# Altium schematic sheet Power.SchDoc: Power
size A3; CompanyName: Green Team Twente; Organization: Green Team Twente; Revision: V1.1; SheetNumber: 5; SheetTotal: 10; Team: 2024; Subsystem: Embedded Systems; SPICEModelCacheQRFOQSXK: <root> / <DocumentId>QRFOQSXK</DocumentId> / </root>
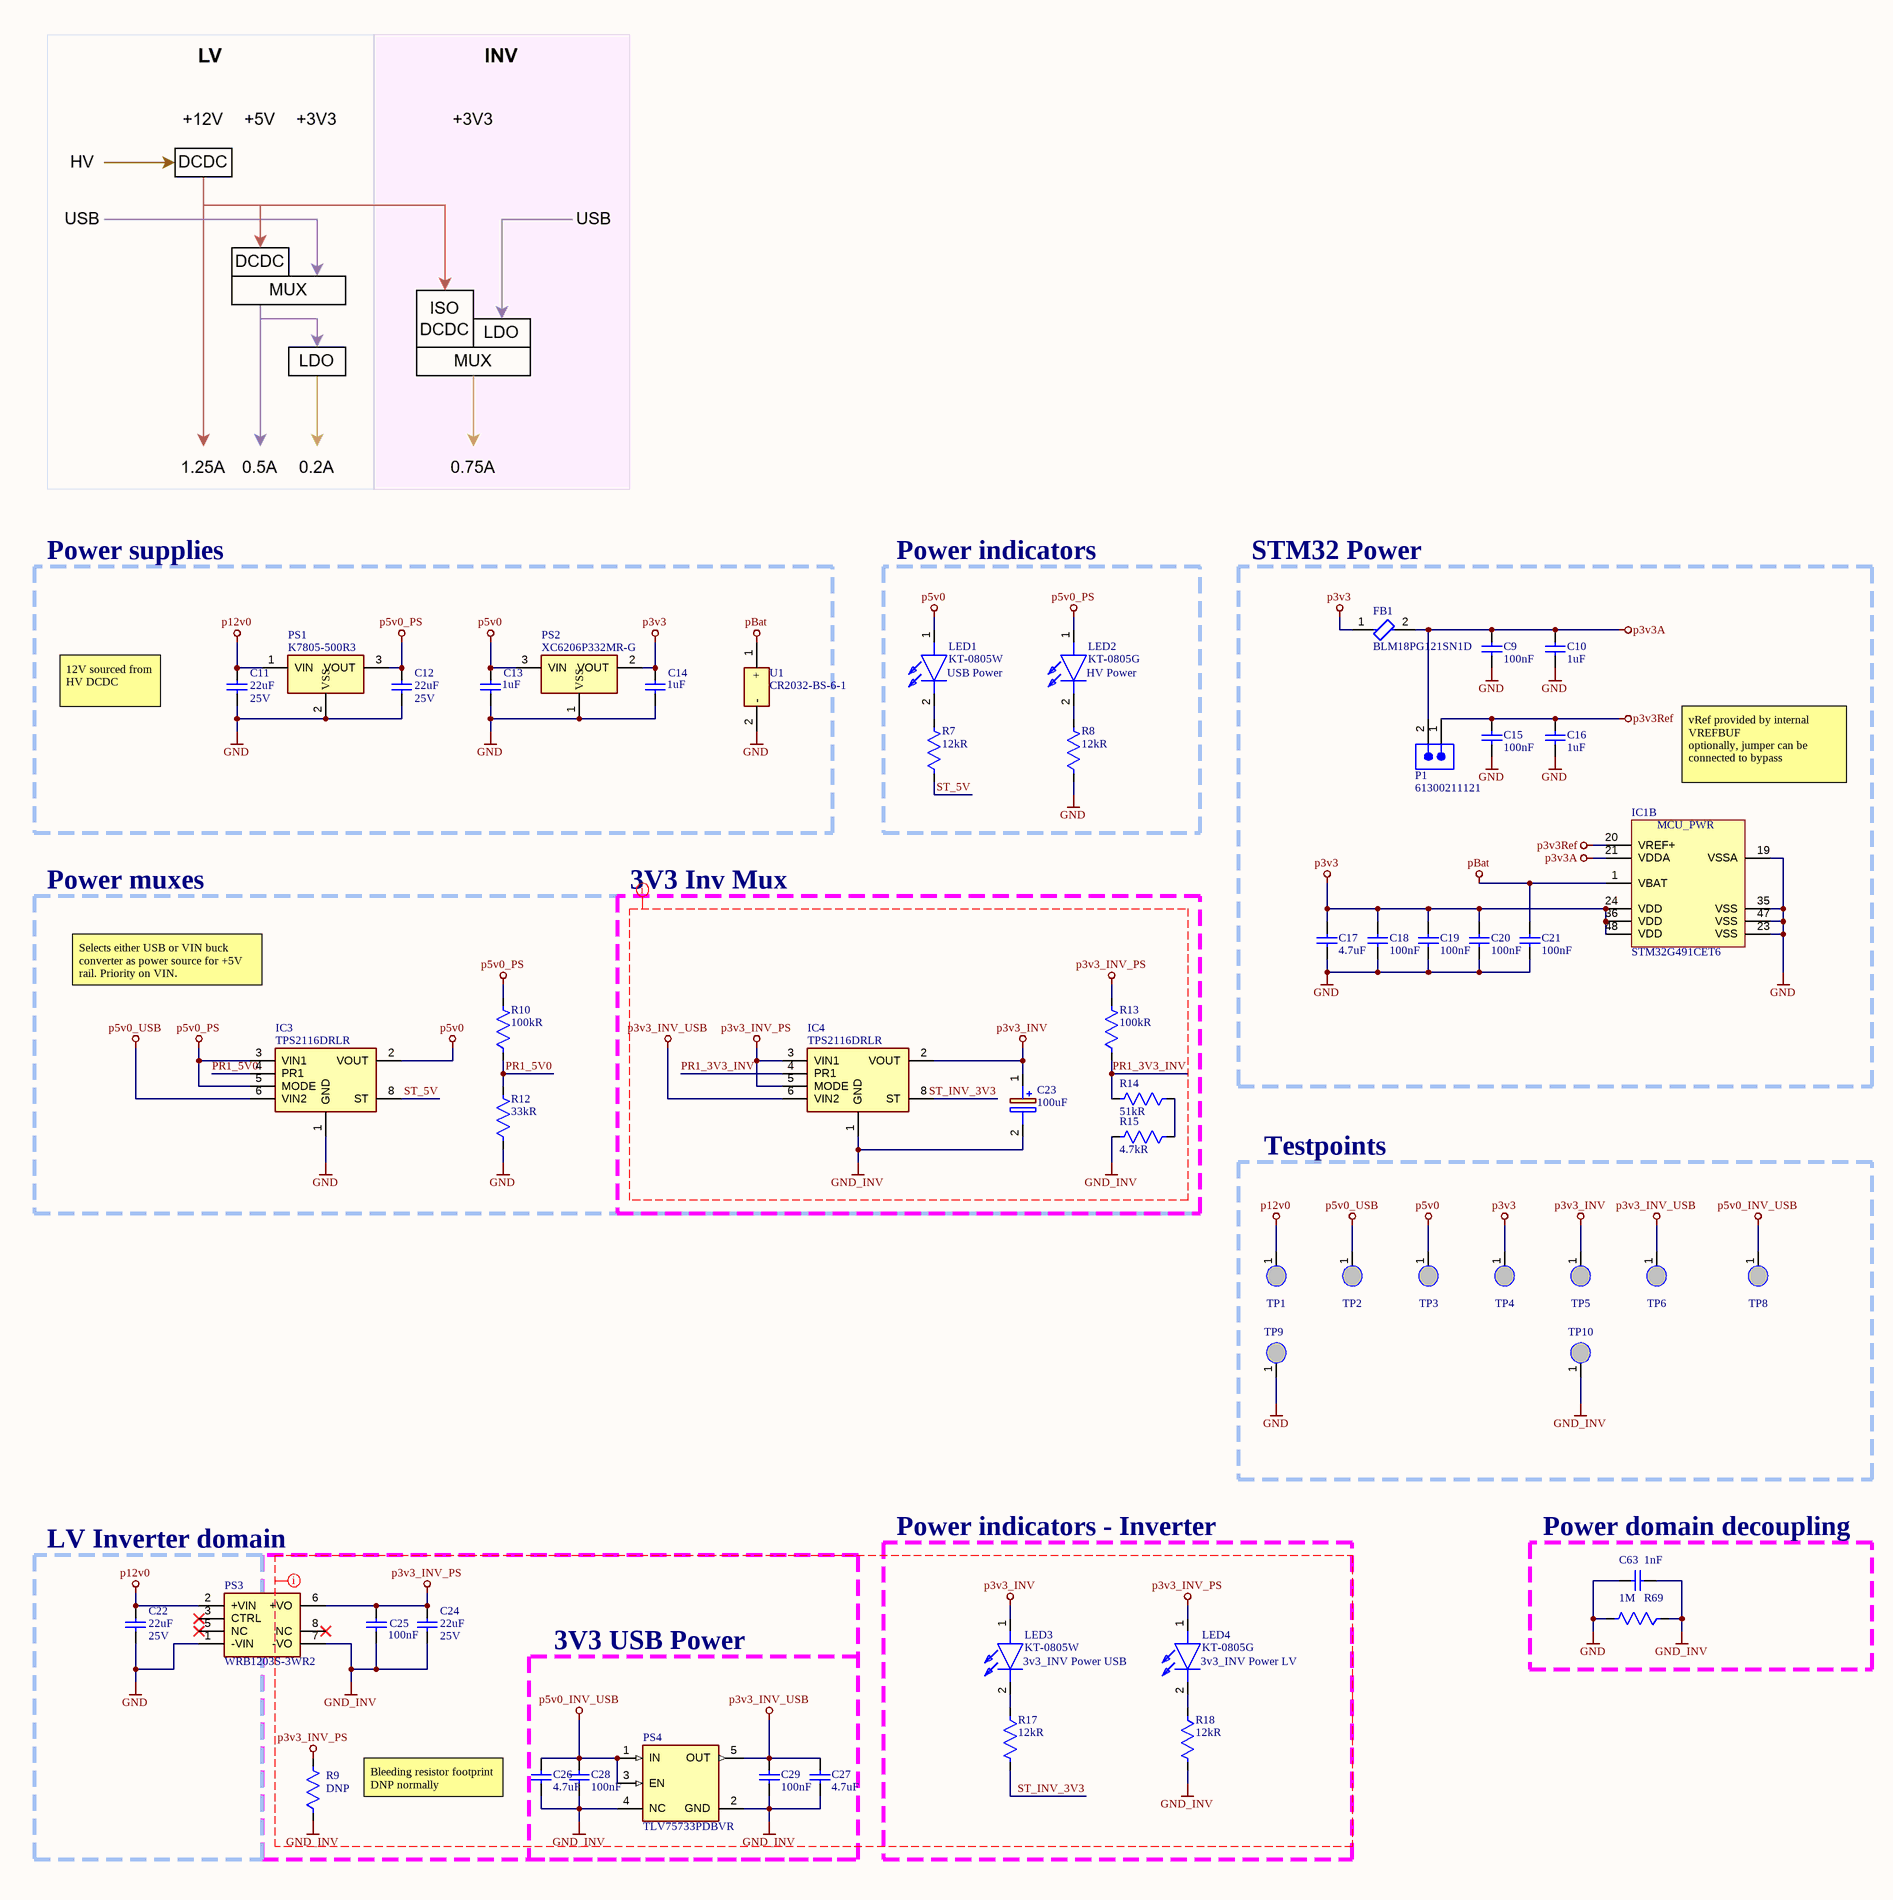
[diagram p0: Power.SchDoc, left]
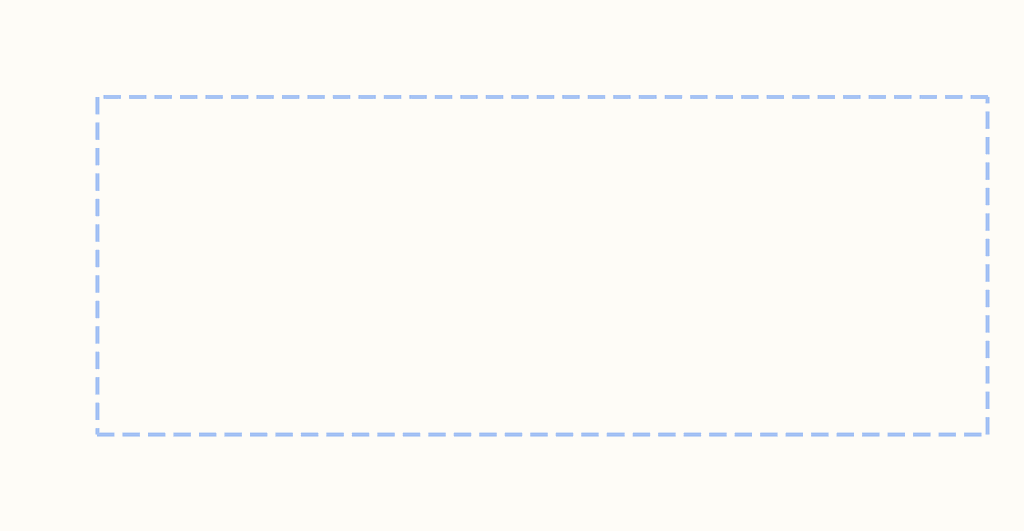
[diagram p1: Power.SchDoc, right]

## Parts
C9  value 100nF  [WCAP-CSGP_0402_L1W0.5H0.5]  (hidden comment: CAP 0402 100nF X7R)
C10  value 1uF  [WCAP-CSGP_0603_L1.6W0.8H0.8_Reflow]  (hidden comment: CAP 0603 1uF X7R)
C11  value 22uF  Voltage Rating: 25V  [WCAP-CSGP_1206_L3.2W1.6H1.15]  (hidden comment: CAP 1206 22uF X7R)
C12  value 22uF  Voltage Rating: 25V  [WCAP-CSGP_1206_L3.2W1.6H1.15]  (hidden comment: CAP 1206 22uF X7R)
C13  value 1uF  [WCAP-CSGP_0603_L1.6W0.8H0.8_Reflow]  (hidden comment: CAP 0603 1uF X7R)
C14  value 1uF  [WCAP-CSGP_0603_L1.6W0.8H0.8_Reflow]  (hidden comment: CAP 0603 1uF X7R)
C15  value 100nF  [WCAP-CSGP_0402_L1W0.5H0.5]  (hidden comment: CAP 0402 100nF X7R)
C16  value 1uF  [WCAP-CSGP_0603_L1.6W0.8H0.8_Reflow]  (hidden comment: CAP 0603 1uF X7R)
C17  value 4.7uF  [WCAP-CSGP_0603_L1.6W0.8H0.8_Reflow]  (hidden comment: CAP 0603 4.7uF X7R)
C18  value 100nF  [WCAP-CSGP_0402_L1W0.5H0.5]  (hidden comment: CAP 0402 100nF X7R)
C19  value 100nF  [WCAP-CSGP_0402_L1W0.5H0.5]  (hidden comment: CAP 0402 100nF X7R)
C20  value 100nF  [WCAP-CSGP_0402_L1W0.5H0.5]  (hidden comment: CAP 0402 100nF X7R)
C21  value 100nF  [WCAP-CSGP_0402_L1W0.5H0.5]  (hidden comment: CAP 0402 100nF X7R)
C22  value 22uF  Voltage Rating: 25V  [WCAP-CSGP_1206_L3.2W1.6H1.15]  (hidden comment: CAP 1206 22uF X7R)
C23  value 100uF  [CAPAE660X800N]  (hidden comment: VEJ101M1ETR-0607)
C24  value 22uF  Voltage Rating: 25V  [WCAP-CSGP_1206_L3.2W1.6H1.15]  (hidden comment: CAP 1206 22uF X7R)
C25  value 100nF  [WCAP-CSGP_0402_L1W0.5H0.5]  (hidden comment: CAP 0402 100nF X7R)
C26  value 4.7uF  [WCAP-CSGP_0603_L1.6W0.8H0.8_Reflow]  (hidden comment: CAP 0603 4.7uF X5R)
C27  value 4.7uF  [WCAP-CSGP_0603_L1.6W0.8H0.8_Reflow]  (hidden comment: CAP 0603 4.7uF X5R)
C28  value 100nF  [WCAP-CSGP_0402_L1W0.5H0.5]  (hidden comment: CAP 0402 100nF X7R)
C29  value 100nF  [WCAP-CSGP_0402_L1W0.5H0.5]  (hidden comment: CAP 0402 100nF X7R)
C63  value 1nF  [WCAP-CSGP_1206_L3.2W1.6H1.15]  (hidden comment: CAP 1206 1nF X7R)
FB1  BLM18PG121SN1D  [FP-BLM18-0_15-t0_8-IPC_A]
IC1  STM32G491CET6  [QFP50P900X900X160-48N]  (part B of 2)
IC3  TPS2116DRLR  [SOTFL50P160X60-8N]
IC4  TPS2116DRLR  [SOTFL50P160X60-8N]
LED1  KT-0805W  [KT0805G]
LED2  KT-0805G  [KT0805G]
LED3  KT-0805W  [KT0805G]
LED4  KT-0805G  [KT0805G]
P1  61300211121  [61300211121]
PS1  K7805-500R3  [K7805500R3]
PS2  XC6206P332MR-G  [SOT95P280X130-3N]
PS3  WRB1203S-3WR2  [WRB1203S3WR2]
PS4  TLV75733PDBVR  [FP-DBV0005A-MFG]
R7  value 12kR  [FP0402]  (hidden comment: RES 0402 12kR 1%)
R8  value 12kR  [FP0402]  (hidden comment: RES 0402 12kR 1%)
R9  value DNP  [RES_SM1206_YAGEORC_N]  (hidden comment: RES 1206 DNP 1%)
R10  value 100kR  [FP0402]  (hidden comment: RES 0402 100kR 1%)
R12  value 33kR  [FP0402]  (hidden comment: RES 0402 33kR 1%)
R13  value 100kR  [FP0402]  (hidden comment: RES 0402 100kR 1%)
R14  value 51kR  [FP0402]  (hidden comment: RES 0402 51kR 1%)
R15  value 4.7kR  [FP0402]  (hidden comment: RES 0402 4.7kR 1%)
R17  value 12kR  [RES_SM0603_YAGEORC_N]  (hidden comment: RES 0603 12kR 1%)
R18  value 12kR  [RES_SM0603_YAGEORC_N]  (hidden comment: RES 0603 12kR 1%)
R69  value 1M  [RES_SM1206_YAGEORC_N]  (hidden comment: RES 1206 1M 1%)
TP1  GTT_ProbeerPunt  [GTT_ProbeerPuntFP]  (value not drawn)  (no BOM)
TP2  GTT_ProbeerPunt  [GTT_ProbeerPuntFP]  (value not drawn)  (no BOM)
TP3  GTT_ProbeerPunt  [GTT_ProbeerPuntFP]  (value not drawn)  (no BOM)
TP4  GTT_ProbeerPunt  [GTT_ProbeerPuntFP]  (value not drawn)  (no BOM)
TP5  GTT_ProbeerPunt  [GTT_ProbeerPuntFP]  (value not drawn)  (no BOM)
TP6  GTT_ProbeerPunt  [GTT_ProbeerPuntFP]  (value not drawn)  (no BOM)
TP8  GTT_ProbeerPunt  [GTT_ProbeerPuntFP]  (value not drawn)  (no BOM)
TP9  GTT_ProbeerPunt  [GTT_ProbeerPuntFP]  (value not drawn)  (no BOM)
TP10  GTT_ProbeerPunt  [GTT_ProbeerPuntFP]  (value not drawn)  (no BOM)
U1  CR2032-BS-6-1  [CR2032BS61]

## Blocks framed on the sheet
Power supplies: C11-C14 PS1 PS2 U1
Power indicators: LED1 LED2 R7 R8
STM32 Power: C9 C10 C15-C21 FB1 IC1 P1
Power muxes: IC3 R10 R12
3V3 Inv Mux: C23 IC4 R13-R15
Testpoints: TP1-TP6 TP8-TP10
LV Inverter domain: C22 PS3
Power indicators - Inverter: LED3 LED4 R17 R18
Power domain decoupling: C63 R69
3V3 USB Power: C26-C29 PS4

## Nets
GND: C9.1 C10.2 C11.1 C12.1 C13.1 C14.1 C15.1 C16.2 C17.2 C18.1 C19.1 C20.1 C21.1 C22.1 C63.1 IC1.19(VSSA) IC1.23(VSS) IC1.35(VSS) IC1.47(VSS) IC3.1(GND) PS1.2(VSS) PS2.1(VSS) PS3.1(-VIN) R8.1 R12.1 R69.2 TP9.1 U1.2(-)
GND_INV: C23.2(-) C24.1 C25.1 C26.2 C27.2 C28.1 C29.1 C63.2 IC4.1(GND) PS3.7(-VO) PS4.2(GND) PS4.4(NC) R9.1 R15.2 R18.2 R69.1 TP10.1
p3v3: C14.2 C17.1 C18.2 C19.2 C20.2 FB1.1 IC1.24(VDD) IC1.36(VDD) IC1.48(VDD) PS2.2(VOUT) TP4.1
p3v3_INV: C23.1(+) IC4.2(VOUT) LED3.1(A) TP5.1
p3v3_INV_PS: C24.2 C25.2 IC4.3(VIN1) IC4.5(MODE) LED4.1(A) PS3.6(+VO) R9.2 R13.2
p3v3_INV_USB: C27.1 C29.2 IC4.6(VIN2) PS4.5(OUT) TP6.1
p3v3A: C9.2 C10.1 FB1.2 IC1.21(VDDA) P1.2
p3v3Ref: C15.2 C16.1 IC1.20(VREF+) P1.1
p5v0: C13.2 IC3.2(VOUT) LED1.1(A) PS2.3(VIN) TP3.1
p5v0_INV_USB: C26.1 C28.2 PS4.1(IN) PS4.3(EN) TP8.1
p5v0_PS: C12.2 IC3.3(VIN1) IC3.5(MODE) LED2.1(A) PS1.3(VOUT) R10.2
p5v0_USB: IC3.6(VIN2) TP2.1
p12v0: C11.2 C22.2 PS1.1(VIN) PS3.2(+VIN) TP1.1
pBat: C21.2 IC1.1(VBAT) U1.1(+)
PR1_3V3_INV: IC4.4(PR1) R13.1 R14.2
PR1_5V0: IC3.4(PR1) R10.1 R12.2
ST_5V: IC3.8(ST) R7.1
ST_INV_3V3: IC4.8(ST) R17.2
NetLED1_2: LED1.2(K) R7.2
NetLED2_2: LED2.2(K) R8.2
NetLED3_2: LED3.2(K) R17.1
NetLED4_2: LED4.2(K) R18.1
NetR14_1: R14.1 R15.1

Not connected (* = marked no-connect by the designer): PS3 3(CTRL)* 5(NC)* 8(NC)*

## Layout directives
net class INV: GND_INV, p3v3_INV, p3v3_INV_PS, p3v3_INV_USB, p5v0_INV_USB, PR1_3V3_INV, ST_INV_3V3

## Notes on the sheet
- 12V sourced from HV DCDC
- (near LED1) USB Power
- (near LED2) HV Power
- vRef provided by internal VREFBUF
  optionally, jumper can be connected to bypass
- Selects either USB or VIN buck converter as power source for +5V rail. Priority on VIN.
- (near LED3) 3v3_INV Power USB
- (near LED4) 3v3_INV Power LV
- Bleeding resistor footprint
  DNP normally
- Team
- Authors
- Revision
- Title
- Project
- Subsystem
- File
- Sheet
- //
- (in symbol CMP-031-00032-4, part B) MCU_PWR

## Library data of the parts
C9 C15 C18-C21 C25 C28 C29 = CMP-001-01308-5: GTT Standard 0402 non-polarized capacitor; Pins: 2; Case/Package: 0402; Category: Multilayer Ceramic Chip Capacitors; Ceramic Type: X7R; JLCPCB Part #: C1525
C10 C13 C14 C16 C17 C26 C27 = CMP-001-01309-1: GTT Standard 0603 non-polarized capacitor; Case/Package: 0603; Category: Multilayer Ceramic Chip Capacitors; Pins: 2
  C10 C13 C14 C16: Ceramic Type: X7R; JLCPCB Part #: C15849
  C17: Ceramic Type: X7R; JLCPCB Part #: C19666
  C26 C27: Ceramic Type: X5R; JLCPCB Part #: C19666
C11 C12 C22 C24 = CMP-001-01311-1: GTT Standard 1206 non-polarized capacitor; Case/Package: 1206; Ceramic Type: X7R; Category: Multilayer Ceramic Chip Capacitors; Pins: 2; JLCPCB Part #: C12891
C23 = VEJ101M1ETR-0607: Capacitor Polarised; Manufacturer_Name: Lelon; Datasheet Link: https://www.mouser.de/datasheet/2/231/161587198639-2307150.pdf; Height: 8mm; Manufacturer_Part_Number: VEJ101M1ETR-0607; JLCPCB Part #: C176664
C63 = CMP-001-01311-1: GTT Standard 1206 non-polarized capacitor; Voltage Rating: 2kV; Case/Package: 1206; Ceramic Type: X7R; Category: Multilayer Ceramic Chip Capacitors; Pins: 2; JLCPCB Part #: C9196
FB1 = CMP-0686-00557-7: Chip Ferrite Bead, 0603, 120Ω @ 100MHz, 0.05Ω, 25%, 2A; Impedance: 120R; Number of Circuits: 1; Shielding: Unshielded; Material: Steel; DC Resistance (DCR): 50mR; Case Code (Imperial): 0603; RoHS Compliant: Yes; Number of Pins: 2; Min Operating Temperature: -55°C; Case Code (Metric): 1608; Frequency: 100MHz; Length: 1.6mm; Test Frequency: 100MHz; Max Operating Temperature: 125°C; Packaging: Tape and Reel; Max Current Rating: 2A; Termination: SMD/SMT; Lead Free: Lead Free; Max DC Current: 2A; Case/Package: 0603; Height: 0.8mm; Current Rating: 2A; Radiation Hardening: No; Core Material: Ferrite; DC Current: 2A; REACH SVHC: No SVHC; Package Quantity: 1; Depth: 0.8mm; Number of Lines: 1; Tolerance: 25%; Width: 0.8mm
IC1 = CMP-031-00032-4: ARM Microcontrollers - MCU Mainstream Arm Cortex-M4+ MCU 170MHz with 512Kbytes of Flash memory; Manufacturer_Name: STMicroelectronics; Arrow Part Number: STM32G491CET6; Source: TempSchematics.schlib; Mouser Part Number: 511-STM32G491CET6; Datasheet Link: https://cz.mouser.com/datasheet/2/389/dm00654712-2042072.pdf; Manufacturer_Part_Number: STM32G491CET6; Design Item ID: STM32G491CET6; Mouser Price/Stock: https://www.mouser.co.uk/ProductDetail/STMicroelectronics/STM32G491CET6?qs=eP2BKZSCXI5LxAF%2FNuF5Tg%3D%3D; Arrow Price/Stock: https://www.arrow.com/en/products/stm32g491cet6/stmicroelectronics?region=nac; Height: 1.6mm
IC3 IC4 = CMP-031-00025-3: Power MUX; pin to pad: 2>2+7; Manufacturer_Name: Texas Instruments; Datasheet Link: https://www.ti.com/lit/gpn/tps2116; Manufacturer_Part_Number: TPS2116DRLR; Design Item ID: TPS2116DRLR; Arrow Price/Stock: https://www.arrow.com/en/products/tps2116drlr/texas-instruments?region=nac; Mouser Price/Stock: https://www.mouser.co.uk/ProductDetail/Texas-Instruments/TPS2116DRLR?qs=aP1CjGhiNiGo3XAyXcVPaQ%3D%3D; Mouser Part Number: 595-TPS2116DRLR; Source: TempSchematics.schlib; Arrow Part Number: TPS2116DRLR; Height: 0.6mm
LED1-LED4 = KT-0805G: LED; Manufacturer_Name: Hubei KENTO Elec; Datasheet Link: https://jlcpcb.com/api/file/downloadByFileSystemAccessId/8639582106239348736; Height: 0.95mm; Manufacturer_Part_Number: KT-0805G
  LED1 LED3: JLCPCB Part #: C34499
  LED2 LED4: JLCPCB Part #: C2297
P1 = CMP-002-00755-1: WR-PHD Pin Header, THT, Vertical, pitch 2.54mm, 1 Row, 2P; Manufacturer: Wurth Elektronik; Withstanding Voltage: 500V; Working Voltage: 250V; Contact Resistance: 20mO; Rated Current: 3A; ComponentLink2URL: https://www.we-online.com/redexpert/spec/61300211121?ad; ComponentLink1URL: https://www.we-online.com/redexpert/article/61300211121?ad; Category: Board-to-Board Connectors; Manufacturer Part Number: 61300211121; ComponentLink2Description: Datasheet Link; ComponentLink1Description: Website Link; Number of Rows: 1; Pins: 2; Source: WR-PHD.SchLib; Design Item ID: 61300211121; Pin Count: 2; Orientation: Vertical; Pitch: 2.54mm; Component Type: Standard; Mount: Through Hole; Match Code: WR-PHD; Packaging: Bag; Operating Temperature Min: -40°C; Gender: Pin Header; Operating Temperature Max: 105°C
PS1 = K7805-500R3: Power Supply; Manufacturer_Name: EVISUN; Height: 10.41mm; Manufacturer_Part_Number: K7805-500R3; JLCPCB Part #: C19188491
PS2 = XC6206P332MR-G: Power Supply; Manufacturer_Name: Torex; Datasheet Link: https://www.torexsemi.com/file/xc6206/XC6206.pdf; Height: 1.3mm; Manufacturer_Part_Number: XC6206P332MR-G; Mouser Part Number: 865-XC6206P332MR-G; Mouser Price/Stock: https://www.mouser.co.uk/ProductDetail/Torex-Semiconductor/XC6206P332MR-G?qs=AsjdqWjXhJ%2FXxNpRY3zZ8g%3D%3D
PS3 = WRB1203S-3WR2: Power Supply; Manufacturer_Name: EVISUN; Datasheet Link: https://jlc-prod-smt.oss-eu-central-1.aliyuncs.com/smtDataManualFile/8763072730084188160-C22437321.pdf?response-content-disposition=attachment%3B%20filename%3DC22437321.pdf%3B%20filename%2A%3DUTF-8%27%27C22437321.pdf&x-oss-date=20260715T193454Z&x-oss-expires=3600&x-oss-security-token=CAISgAN1q6Ft5B2yfSjIr5vGB4%2FWvadn2vqmc1aEsUE0QuZpjqjbpjz2IHhMdHJsAOodtv0%2FmmhT6PkclqRLcbhpcmfjV%2BZHzLB8qZ1MhF5f4J7b16cNrbH4M4H6aXeirtuwDsz9SNTCALjPD3nPii50x5bjaDymRCbLGJaViJlhHLN1Ow6jdmhpCctxLAlvo9NgFxm3D%2Fu2NQPwiWf9FVdhvhEG6Vly8qOi2MaRmFy8yFTx0b0SvJ%2BjYMrmPctoN9JnSdC5mfdzau3a1TJ84gRD0a5wkaVA1zbDs5bfISEIuUzebreLqY03dV4mOvdqIcMe8qigz88fk%2FfIioH6xyxKOexoSCnFTOiiupCcQLPyao9jLu6iayqViY7QaIOTqQohZmkAMwVOasAsI3Ngh4zF97Qt0cVNkXO9gWfLI8DtuMleWgprXccO%2BnSgc5lCkRRYwGs1287ugXlSQzo890KPDAEovaKCnZ2ZSfh7Y4sNknI6i%2Bfc2Se2MIkIyKE0YqKWD5sagAECs9NCpk8KgfXfWYxhKhKZsha9ngqEXyXXVVOpb2GGT6djF3S%2FLTKh30%2B6uTt7oH6XhzPlB7WR%2Fa7FsvHfaJ62Hu2KaBZEBf7KJcteyMD33hzIrNZl9%2F9XvPXuCryTgxV1ie4rkrvTaUkWCQr%2BRp6R1%2FN9Ic7TFTQ1orsPZrHwHCAA&x-oss-signature-version=OSS4-HMAC-SHA256&x-oss-credential=STS.NXsL5bPxFm8Mqp5UAaNiEampD%2F20260715%2Feu-central-1%2Foss%2Faliyun_v4_request&x-oss-signature=73c165591a835ffcff11ee9ad605e23bde33f7af0c5ec7bf6709df0808843322; Height: 12.25mm; Manufacturer_Part_Number: WRB1203S-3WR2; JLCPCB Part #: C22437321
PS4 = CMP-04917-000028-1: IC REG LINEAR 3.3V 1A SOT23-5; Manufacturer: Texas Instruments; Standoff Height: 0mm; Min Supply Voltage: 1.45V; Dropout Voltage: 1350mV; Output Type: Fixed; Max Junction Temp: +125°C; Max Supply Voltage: 5.5V; Number Of Outputs: 1; Accuracy Percentage: 1%; Manufacturer Part Number: TLV75733PDBVR; ComponentLink2Description: Datasheet; Temperature: -40°C to +125°C; RoHS: TRUE; ComponentLink2URL: http://www.ti.com/lit/ds/symlink/tlv757p.pdf; Output Voltage: 3.3V; Mouser Description: 1-A low-IQ small-size low-dropout (LDO) regulator 5-SOT-23 -40 to 125; Ipc Land Pattern Name: SOT95P280X145-5; Device Class L2: Power Management ICs; Package: DBV0005A; Height: 1.45mm; Category: IC; Digikey Description: IC REG LINEAR 3.3V 1A SOT23-5; Temperature Range High: +125°C; Octopart: https://octopart.com/tlv75733pdbvr-texas+instruments-91437073; Temperature Range Low: -40°C; Device Class L3: Voltage Regulators - Linear; Output Current: 1A; Device Class L1: Integrated Circuits (ICs); Automotive: No; Lead Free: Yes
R7 R8 R10 R12-R15 = CMP-009-00204-17: GTT Standard 0402 Resistor; Voltage Rating: 50V; Power: 62.5mW; Case/Package: 0402; Mounting Technology: SMD; Design Item ID: RES 0402; Source: Passives.SchLib; Tolerance: 1%
  R7 R8: JLCPCB Part #: C25752
  R10 R13: JLCPCB Part #: C25741
  R12: JLCPCB Part #: C25779
  R14: JLCPCB Part #: C25794
  R15: JLCPCB Part #: C25900
R9 R69 = CMP-009-00208-3: GTT Standard 1206 Resistor; Voltage Rating: 50V; Power: 62.5mW; Tolerance: 1%; Case/Package: 1206; Mounting Technology: SMD
  R9: JLCPCB Part #: DNP
  R69: JLCPCB Part #: C17927
R17 R18 = CMP-009-00206-3: GTT Standard 0603 Resistor; Voltage Rating: 50V; Power: 62.5mW; Case/Package: 0603; Tolerance: 1%; Mounting Technology: SMD; JLCPCB Part #: C22790
TP1-TP6 TP8-TP10 = CMP-00030-00001-7: Design Item ID: GTT_ProbeerPunt; Source: GTT_MainComponentLibrary.SchLib
U1 = CR2032-BS-6-1: Undefined or Miscellaneous; Manufacturer_Name: Q&J; Datasheet Link: https://datasheet.lcsc.com/szlcsc/Q-J-CR2032-BS-6-1_C70377.pdf; Height: 6mm; Manufacturer_Part_Number: CR2032-BS-6-1